# Altium project Carte_Propu2026.PrjPCB
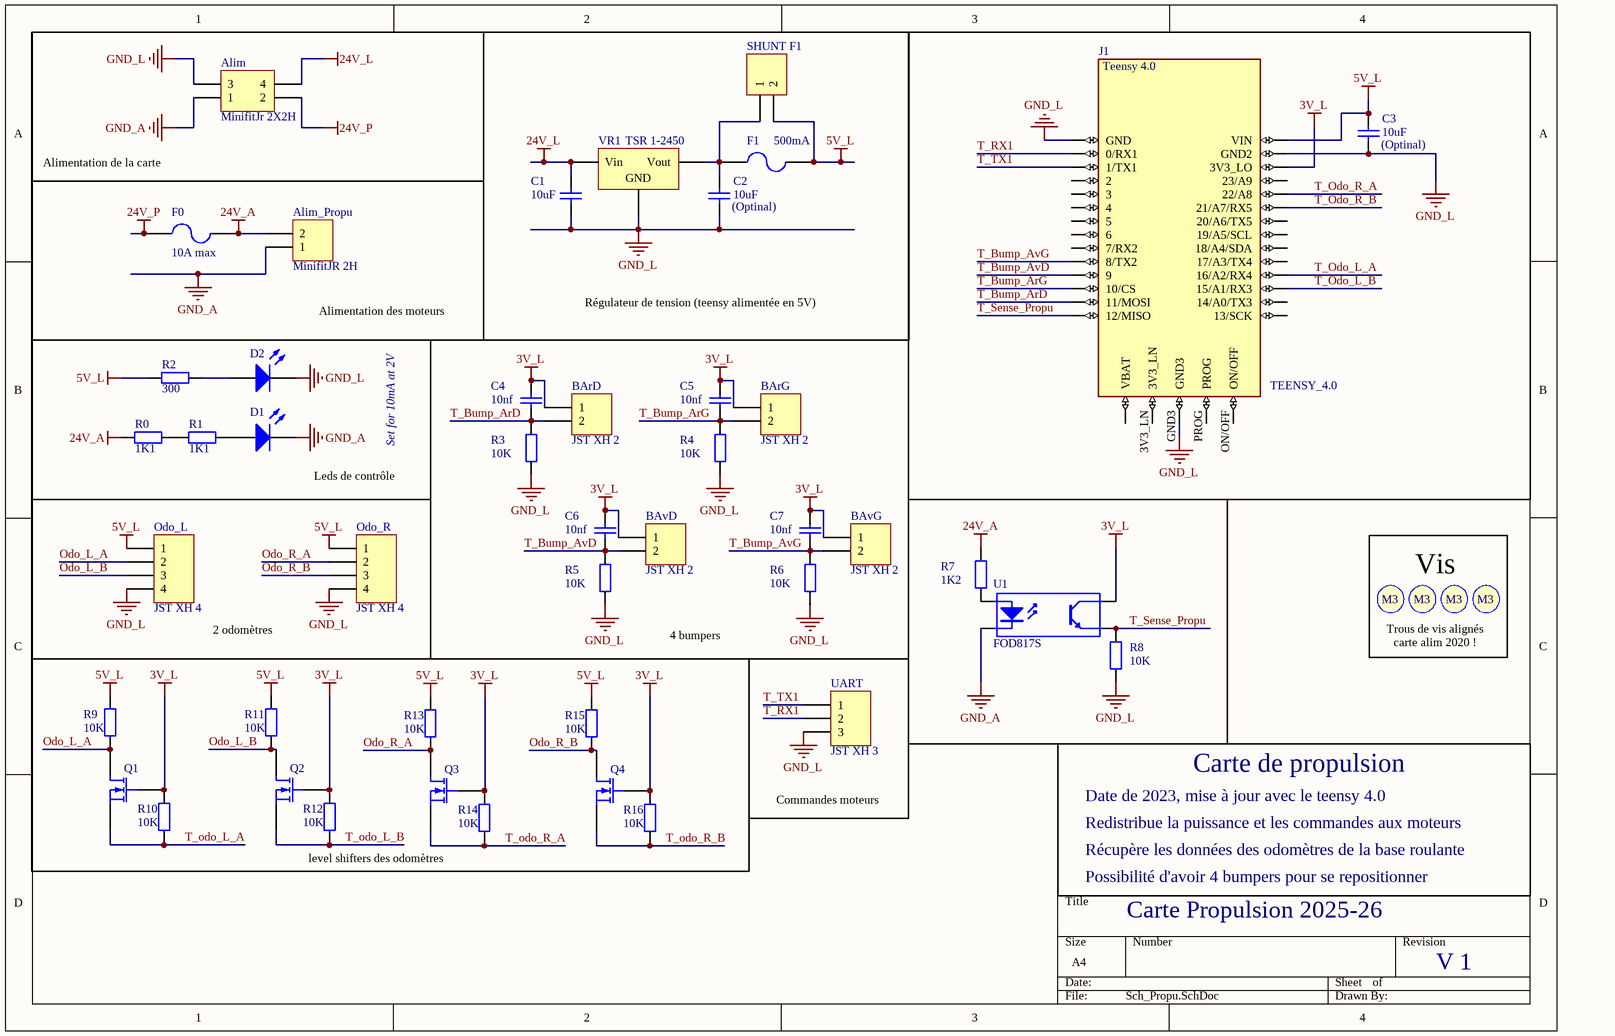
[diagram p0: Sch_Propu.SchDoc]
1 sheet, 49 parts. Net scope: global (net labels, ports and power ports of the same name join across sheets).
Board file: PCB_Propu2026.PcbDoc

## Sheet Sch_Propu.SchDoc
size A4

### Parts
Alim  MinifitJr 2X2H  [MOLEX_MINIFITJR_2X2H]
Alim_Propu  MinifitJR 2H  [Molex_MiniFitJr_2x1H]
BArD  JST XH 2  [S2B-XH-A]
BArG  JST XH 2  [S2B-XH-A]
BAvD  JST XH 2  [S2B-XH-A]
BAvG  JST XH 2  [S2B-XH-A]
C1  value 10uF  [Capacitor 1206]
C2  (Optinal)  value 10uF  [Capacitor 1206]
C3  (Optinal)  value 10uF  [Capacitor 1206]
C4  value 10nf  [Capacitor 1206]  (hidden comment: Cap)
C5  value 10nf  [Capacitor 1206]  (hidden comment: Cap)
C6  value 10nf  [Capacitor 1206]  (hidden comment: Cap)
C7  value 10nf  [Capacitor 1206]  (hidden comment: Cap)
D1  A  [KP-3216SEC]  (value not drawn)
D2  L  [KP-3216SEC]  (value not drawn)
F0  10A max  [Fuse]
F1  500mA  [3.5X2.8X1.9]
J1  TEENSY_4.0  [TEENSY_4.0]
Odo_L  JST XH 4  [S4B-XH-A]
Odo_R  JST XH 4  [S4B-XH-A]
Q1  MOSFET-N  [SOT23_M]  (value not drawn)
Q2  MOSFET-N  [SOT23_M]  (value not drawn)
Q3  MOSFET-N  [SOT23_M]  (value not drawn)
Q4  MOSFET-N  [SOT23_M]  (value not drawn)
R0  value 1K1  [Resistor 1206]  (hidden comment: Res2)
R1  value 1K1  [Resistor 1206]  (hidden comment: Res2)
R2  value 300  [Resistor 1206]  (hidden comment: Res2)
R3  value 10K  [Resistor 1206]  (hidden comment: Res2)
R4  value 10K  [Resistor 1206]  (hidden comment: Res2)
R5  value 10K  [Resistor 1206]  (hidden comment: Res2)
R6  value 10K  [Resistor 1206]  (hidden comment: Res2)
R7  value 1K2  [Resistor 1206]  (hidden comment: Res2)
R8  value 10K  [Resistor 1206]  (hidden comment: Res2)
R9  value 10K  [Resistor 1206]  (hidden comment: Res2)
R10  value 10K  [Resistor 1206]  (hidden comment: Res2)
R11  value 10K  [Resistor 1206]  (hidden comment: Res2)
R12  value 10K  [Resistor 1206]  (hidden comment: Res2)
R13  value 10K  [Resistor 1206]  (hidden comment: Res2)
R14  value 10K  [Resistor 1206]  (hidden comment: Res2)
R15  value 10K  [Resistor 1206]  (hidden comment: Res2)
R16  value 10K  [Resistor 1206]  (hidden comment: Res2)
S1  Screw M3  [Screw M3]  (value not drawn)
S2  Screw M3  [Screw M3]  (value not drawn)
S3  Screw M3  [Screw M3]  (value not drawn)
S4  Screw M3  [Screw M3]  (value not drawn)
SHUNT_F1  Header 2  [HDR1X2]  (value not drawn)
U1  FOD817S  [SOP254P1016X385-4N]
UART  JST XH 3  [S3B-XH-A]
VR1  TSR 1-2450  [TRS]

### Blocks framed on the sheet
Set for 10mA at 2V: D1 D2 R0-R2

### Nets
3V_L: BArD.1 BArG.1 BAvD.1 BAvG.1 C4.2 C5.2 C6.2 C7.2 J1.3V3_LO Q1.2(G) Q2.2(G) Q3.2(G) Q4.2(G) R10.2 R12.2 R14.2 R16.2 U1.4(C)
5V_L: C3.2 F1.2 J1.VIN Odo_L.1 Odo_R.1 R2.1 R9.2 R11.2 R13.2 R15.2 SHUNT_F1.2
24V_A: Alim_Propu.2 F0.2 R0.1 R7.2
24V_L: Alim.4 C1.2 VR1.1(Vin)
24V_P: Alim.2 F0.1
GND_A: Alim.1 Alim_Propu.1 D1.2(K) U1.2(K)
GND_L: Alim.3 C1.1 C2.1 C3.1 D2.2(K) J1.GND J1.GND2 J1.GND3 Odo_L.4 Odo_R.4 R3.2 R4.2 R5.2 R6.2 R8.1 UART.3 VR1.2(GND)
Odo_L_A: Odo_L.2 Q1.1(D) R9.1
Odo_L_B: Odo_L.3 Q2.1(D) R11.1
Odo_R_A: Odo_R.2 Q3.1(D) R13.1
Odo_R_B: Odo_R.3 Q4.1(D) R15.1
T_Bump_ArD: BArD.2 C4.1 J1.11/MOSI R3.1
T_Bump_ArG: BArG.2 C5.1 J1.10/CS R4.1
T_Bump_AvD: BAvD.2 C6.1 J1.9/CS(9) R5.1
T_Bump_AvG: BAvG.2 C7.1 J1.8(8/TX2) R6.1
T_Odo_L_A: J1.16/A2(16/A2/RX4) Q1.3(S) R10.1
T_Odo_L_B: J1.15/A1(15/A1/RX3) Q2.3(S) R12.1
T_Odo_R_A: J1.22/A8 Q3.3(S) R14.1
T_Odo_R_B: J1.21/A7(21/A7/RX5) Q4.3(S) R16.1
T_RX1: J1.0/RX(0/RX1) UART.2
T_Sense_Propu: J1.12/MISO R8.2 U1.3(E)
T_TX1: J1.1/TX(1/TX1) UART.1
NetC2_2: C2.2 F1.1 SHUNT_F1.1 VR1.3(Vout)
NetD1_1: D1.1(A) R1.2
NetD2_1: D2.1(A) R2.2
NetR0_2: R0.2 R1.1
NetR7_1: R7.1 U1.1(A)

Not connected (* = marked no-connect by the designer): J1 2 3/CANTX(3) 3V3_LN 4/CANRX(4) 5 6 7(7/RX2) 13/SCK 14/A0(14/A0/TX3) 17/A3(17/A3/TX4) 18/A4/SDA 19/A5/SCL 20/A6(20/A6/TX5) 23/A9 ON/OFF PROG VBAT\(VBAT)

### Notes on the sheet
- Alimentation de la carte
- Alimentation des moteurs
- Régulateur de tension (teensy alimentée en 5V)
- Leds de contrôle
- Vis
- 2 odomètres
- 4 bumpers
- Trous de vis alignés carte alim 2020 !
- Carte de propulsion
- Commandes moteurs
- Date de 2023, mise à jour avec le teensy 4.0
- Redistribue la puissance et les commandes aux moteurs
- Récupère les données des odomètres de la base roulante
- (near R12) level shifters des odomètres
- Possibilité d'avoir 4 bumpers pour se repositionner
- Carte Propulsion 2025-26
- V 1
- (in symbol Screw M3) M3

### Library data of the parts
Alim = Header 2X2H: Header, 2-Pin, Dual row, Right Angle; LatestRevisionDate: 17-Jul-2002; LatestRevisionNote: Re-released for DXP Platform.; Publisher: Altium Limited
Alim_Propu BArD BArG BAvD BAvG SHUNT_F1 = Header 2: Header, 2-Pin; LatestRevisionDate: 17-Jul-2002; LatestRevisionNote: Re-released for DXP Platform.; Publisher: Altium Limited
C1-C7 = Cap: Capacitor; Published: 8-Jun-2000; LatestRevisionDate: 17-Jul-2002; LatestRevisionNote: Re-released for DXP Platform.; PackageReference: RAD-0.3; Publisher: Altium Limited; PackageDescription: Radial Cap, Thru-Hole; 2 Leads; 0.3 in Pin Spacing
D1 D2 = LED2: Typical RED, GREEN, YELLOW, AMBER GaAs LED; Published: 8-Jun-2000; LatestRevisionDate: 17-Jul-2002; LatestRevisionNote: Re-released for DXP Platform.; PackageVersion: Feb-2002; PackageReference: 3.2X1.6X1.1; Publisher: Altium Limited; PackageDescription: SM LED; 2 Flat Leads
F0 = Fuse 2: Main Fuse; Published: 8-Jun-2000; LatestRevisionDate: 17-Jul-2002; LatestRevisionNote: Re-released for DXP Platform.; PackageReference: PIN-W2/E2.8; Publisher: Altium Limited; PackageDescription: Thru-Hole; 2 Leads
F1 = Fuse 2: Resettable Fuse αA / JF; Published: 8-Jun-2000; LatestRevisionDate: 17-Jul-2002; LatestRevisionNote: Re-released for DXP Platform.; PackageReference: PIN-W2/E2.8; Publisher: Altium Limited; PackageDescription: Thru-Hole; 2 Leads
J1 = TEENSY_4.0: MF: PJRC; MP: Teensy 4.0; SnapEDA_Link: https://www.snapeda.com/parts/Teensy%204.0/PJRC/view-part/?ref=snap; Package: None; Value: *; Check_prices: https://www.snapeda.com/parts/Teensy%204.0/PJRC/view-part/?ref=eda
Odo_L Odo_R = Header 4H: Molex SPOX 4x1H; LatestRevisionDate: 17-Jul-2002; LatestRevisionNote: Re-released for DXP Platform.; Publisher: Altium Limited
Q1-Q4 = MOSFET-N: N-Channel MOSFET; pin to pad: 2>3 3>2; Published: 8-Jun-2000; LatestRevisionDate: 17-Jul-2002; LatestRevisionNote: Re-released for DXP Platform.; PackageVersion: 1995/1996; PackageReference: E3; Publisher: Altium Limited; PackageDescription: TO, Flat Index; 3 In-Line, Axial Leads; Body Dia. 4.6mm; Lead Dia. 0.5 mm (max)
R0-R16 = Res2: Resistor; Published: 8-Jun-2000; LatestRevisionDate: 17-Jul-2002; LatestRevisionNote: Re-released for DXP Platform.; PackageReference: AXIAL-0.4; Publisher: Altium Limited; PackageDescription: Axial Device, Thru-Hole; 2 Leads; 0.4 in Pin Spacing
U1 = Optoisolator1: 4-Pin Phototransistor Optocoupler; Published: 24-Mar-1999; LatestRevisionDate: 04-Mar-2005; LatestRevisionNote: Sch pins 3 & 4 Swapped.; DatasheetVersion: Nov-2003; PackageReference: DIP-4; Publisher: Altium Limited
UART = Header 3H: Header, 3-Pin, Right Angle; LatestRevisionDate: 17-Jul-2002; LatestRevisionNote: Re-released for DXP Platform.; Publisher: Altium Limited
VR1 = Volt Reg: Voltage Regulator; Published: 24-Mar-1999; LatestRevisionDate: 29-May-2009; LatestRevisionNote: IPC-7351 Footprint Added.; PackageReference: D2PAK; Publisher: Altium Limited; PackageDescription: 3-Pin Transistor Outline Package 2.54 mm Pitch, 15.1 mm Lead Span